# Altium schematic sheet STM32F407VxT_simple.SchDoc
size A4
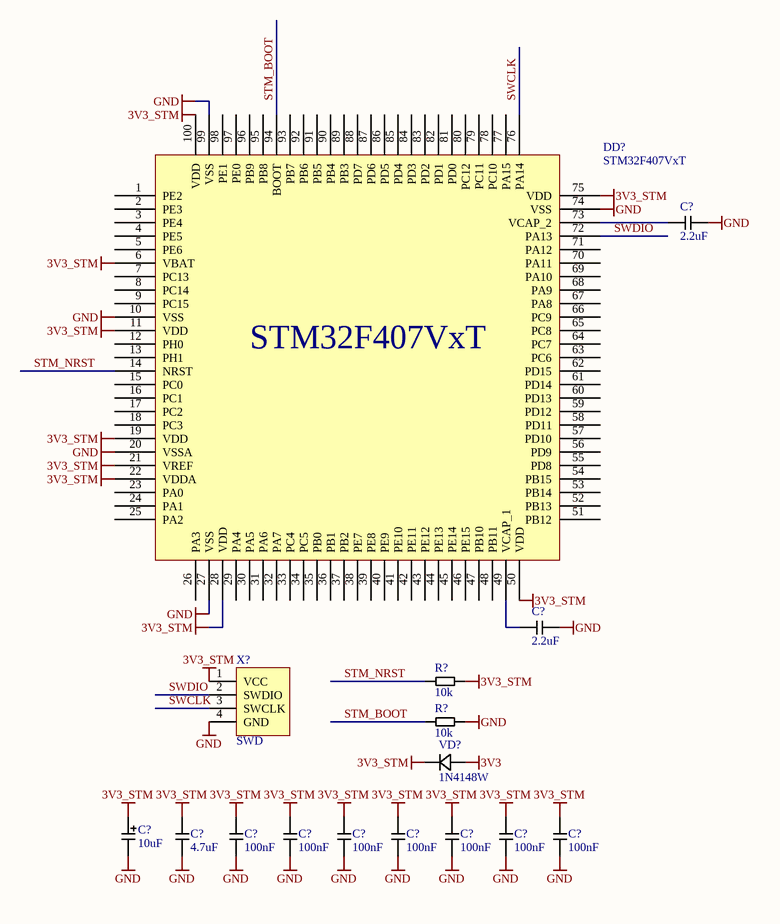
[diagram p0: STM32F407VxT_simple.SchDoc]

## Parts
(Parts that share a designator on the sheet are numbered #1, #2 ... from top to bottom, then left to right.)
C?#1  2.2uF  [C0603]
C?#2  2.2uF  [C0603]
C?#3  10uF  [SMD A]
C?#4  4.7uF  [C0603]
C?#5  100nF  [C0603]
C?#6  100nF  [C0603]
C?#7  100nF  [C0603]
C?#8  100nF  [C0603]
C?#9  100nF  [C0603]
C?#10  100nF  [C0603]
C?#11  100nF  [C0603]
DD?  STM32F407VxT  [LQFP-100]
R?#1  10k  [R0603]
R?#2  10k  [R0603]
VD?  1N4148W  [SOD-123]
X?  SWD  [SWD-4]

## Nets
3V3: VD?.1(K)
3V3_STM: C?#3.1 C?#4.1 C?#5.1 C?#6.1 C?#7.1 C?#8.1 C?#9.1 C?#10.1 C?#11.1 DD?.6(VBAT) DD?.11(VDD) DD?.19(VDD) DD?.21(VREF) DD?.22(VDDA) DD?.28(VDD) DD?.50(VDD) DD?.75(VDD) DD?.100(VDD) R?#1.2 VD?.2(A) X?.1(VCC)
GND: C?#1.1 C?#2.1 C?#3.2 C?#4.2 C?#5.2 C?#6.2 C?#7.2 C?#8.2 C?#9.2 C?#10.2 C?#11.2 DD?.10(VSS) DD?.20(VSSA) DD?.27(VSS) DD?.74(VSS) DD?.99(VSS) R?#2.2 X?.4(GND)
STM_BOOT: DD?.94(BOOT) R?#2.1
STM_NRST: DD?.14(NRST) R?#1.1
SWCLK: DD?.76(PA14) X?.3(SWCLK)
SWDIO: DD?.72(PA13) X?.2(SWDIO)
NetC?#1_2: C?#1.2 DD?.73(VCAP_2)
NetC?#2_2: C?#2.2 DD?.49(VCAP_1)

Not connected (* = marked no-connect by the designer): DD? 1(PE2) 2(PE3) 3(PE4) 4(PE5) 5(PE6) 7(PC13) 8(PC14) 9(PC15) 12(PH0) 13(PH1) 15(PC0) 16(PC1) 17(PC2) 18(PC3) 23(PA0) 24(PA1) 25(PA2) 26(PA3) 29(PA4) 30(PA5) 31(PA6) 32(PA7) 33(PC4) 34(PC5) 35(PB0) 36(PB1) 37(PB2) 38(PE7) 39(PE8) 40(PE9) 41(PE10) 42(PE11) 43(PE12) 44(PE13) 45(PE14) 46(PE15) 47(PB10) 48(PB11) 51(PB12) 52(PB13) 53(PB14) 54(PB15) 55(PD8) 56(PD9) 57(PD10) 58(PD11) 59(PD12) 60(PD13) 61(PD14) 62(PD15) 63(PC6) 64(PC7) 65(PC8) 66(PC9) 67(PA8) 68(PA9) 69(PA10) 70(PA11) 71(PA12) 77(PA15) 78(PC10) 79(PC11) 80(PC12) 81(PD0) 82(PD1) 83(PD2) 84(PD3) 85(PD4) 86(PD5) 87(PD6) 88(PD7) 89(PB3) 90(PB4) 91(PB5) 92(PB6) 93(PB7) 95(PB8) 96(PB9) 97(PE0) 98(PE1)

## Library data of the parts
C?#1 C?#2 C?#4-C?#11 = C: Capacitor
C?#3 = CP: Capacitor polarized
DD? = STM32F407VxT: ST Cortex-M4F MCU LQFP-100
R?#1 R?#2 = R: Resistor
VD? = Diode: SMD diode
X? = SWD_4: SWD connector